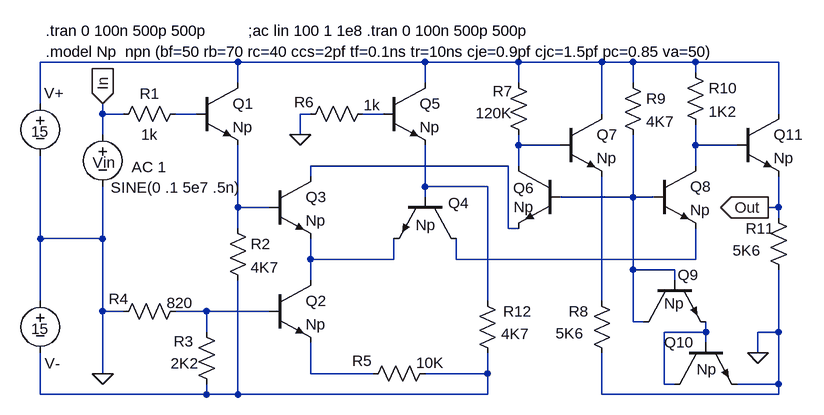
[diagram p0: schematic 9Q_50Mhz.asc]
9Q_50Mhz.asc, the LTspice schematic file:
Version 4
SHEET 1 1232 680
WIRE 32 144 32 80
WIRE 32 352 32 224
WIRE 32 448 32 352
WIRE 32 592 32 528
WIRE 128 160 128 144
WIRE 128 192 128 160
WIRE 128 352 32 352
WIRE 128 352 128 272
WIRE 128 464 128 352
WIRE 128 560 128 464
WIRE 160 160 128 160
WIRE 160 464 128 464
WIRE 272 160 240 160
WIRE 288 464 240 464
WIRE 288 496 288 464
WIRE 288 592 32 592
WIRE 288 592 288 576
WIRE 336 80 32 80
WIRE 336 112 336 80
WIRE 336 304 336 208
WIRE 336 336 336 304
WIRE 336 592 288 592
WIRE 336 592 336 416
WIRE 384 304 336 304
WIRE 384 464 288 464
WIRE 432 192 432 160
WIRE 448 160 432 160
WIRE 448 256 448 240
WIRE 448 384 448 352
WIRE 448 416 448 384
WIRE 448 560 448 512
WIRE 544 560 448 560
WIRE 560 160 528 160
WIRE 576 384 448 384
WIRE 576 384 576 352
WIRE 624 80 336 80
WIRE 624 112 624 80
WIRE 624 272 624 208
WIRE 624 288 624 272
WIRE 672 384 672 352
WIRE 720 272 624 272
WIRE 720 448 720 272
WIRE 720 560 624 560
WIRE 720 560 720 528
WIRE 720 592 336 592
WIRE 720 592 720 560
WIRE 752 240 448 240
WIRE 752 336 752 240
WIRE 768 80 624 80
WIRE 768 112 768 80
WIRE 768 208 768 192
WIRE 768 240 768 208
WIRE 768 336 752 336
WIRE 832 208 768 208
WIRE 896 80 768 80
WIRE 896 160 896 80
WIRE 896 448 896 256
WIRE 896 592 896 528
WIRE 944 80 896 80
WIRE 944 112 944 80
WIRE 944 288 832 288
WIRE 944 288 944 192
WIRE 944 400 944 288
WIRE 944 480 944 400
WIRE 960 480 944 480
WIRE 976 288 944 288
WIRE 992 576 992 496
WIRE 1008 400 944 400
WIRE 1008 416 1008 400
WIRE 1008 576 992 576
WIRE 1040 80 944 80
WIRE 1040 96 1040 80
WIRE 1040 208 1040 176
WIRE 1040 240 1040 208
WIRE 1040 384 672 384
WIRE 1040 384 1040 336
WIRE 1056 496 992 496
WIRE 1056 496 1056 480
WIRE 1056 512 1056 496
WIRE 1104 208 1040 208
WIRE 1136 528 1136 496
WIRE 1168 80 1040 80
WIRE 1168 160 1168 80
WIRE 1168 304 1152 304
WIRE 1168 304 1168 256
WIRE 1168 320 1168 304
WIRE 1168 496 1136 496
WIRE 1168 496 1168 400
WIRE 1168 576 1104 576
WIRE 1168 576 1168 496
WIRE 1168 592 896 592
WIRE 1168 592 1168 576
FLAG 128 560 0
FLAG 1136 528 0
FLAG 1152 304 Out
IOPIN 1152 304 Out
FLAG 128 144 In
IOPIN 128 144 In
FLAG 432 192 0
SYMBOL voltage 32 128 R0
WINDOW 0 6 0 Left 0
WINDOW 3 -14 59 Left 0
WINDOW 123 0 0 Left 0
WINDOW 39 0 0 Left 0
SYMATTR InstName V+
SYMATTR Value 15
SYMBOL voltage 32 432 R0
WINDOW 0 7 112 Left 0
WINDOW 3 -14 59 Left 0
WINDOW 123 0 0 Left 0
WINDOW 39 0 0 Left 0
SYMATTR InstName V-
SYMATTR Value 15
SYMBOL res 256 144 R90
WINDOW 0 0 56 VBottom 0
WINDOW 3 32 56 VTop 0
SYMATTR InstName R1
SYMATTR Value 1k
SYMBOL npn3 272 112 R0
SYMATTR InstName Q1
SYMATTR Value Np
SYMBOL res 320 320 R0
SYMATTR InstName R2
SYMATTR Value 4K7
SYMBOL npn3 384 256 R0
SYMATTR InstName Q3
SYMATTR Value Np
SYMBOL npn3 384 416 R0
SYMATTR InstName Q2
SYMATTR Value Np
SYMBOL res 272 480 R0
WINDOW 0 -35 30 Left 0
WINDOW 3 -39 64 Left 0
SYMATTR InstName R3
SYMATTR Value 2K2
SYMBOL res 256 448 R90
WINDOW 0 12 103 VBottom 0
WINDOW 3 -13 9 VTop 0
SYMATTR InstName R4
SYMATTR Value 820
SYMBOL res 528 576 R270
WINDOW 0 20 -1 VTop 0
WINDOW 3 48 104 VBottom 0
SYMATTR InstName R5
SYMATTR Value 10K
SYMBOL npn3 672 288 R90
WINDOW 0 9 -20 VRight 0
WINDOW 3 43 32 VRight 0
SYMATTR InstName Q4
SYMATTR Value Np
SYMBOL npn3 560 112 R0
SYMATTR InstName Q5
SYMATTR Value Np
SYMBOL res 704 432 R0
WINDOW 0 40 32 Left 0
WINDOW 3 37 67 Left 0
SYMATTR InstName R12
SYMATTR Value 4K7
SYMBOL npn3 832 240 M0
WINDOW 0 40 34 Left 0
WINDOW 3 41 63 Left 0
SYMATTR InstName Q6
SYMATTR Value Np
SYMBOL res 752 96 R0
WINDOW 0 -24 29 Left 0
WINDOW 3 -50 63 Left 0
SYMATTR InstName R7
SYMATTR Value 120K
SYMBOL npn3 832 160 R0
SYMATTR InstName Q7
SYMATTR Value Np
SYMBOL res 880 432 R0
WINDOW 0 -35 32 Left 0
WINDOW 3 -55 66 Left 0
SYMATTR InstName R8
SYMATTR Value 5K6
SYMBOL npn3 976 240 R0
SYMATTR InstName Q8
SYMATTR Value Np
SYMBOL res 928 96 R0
SYMATTR InstName R9
SYMATTR Value 4K7
SYMBOL res 1024 80 R0
SYMATTR InstName R10
SYMATTR Value 1K2
SYMBOL npn3 960 416 M90
WINDOW 0 -8 85 VLeft 0
WINDOW 3 36 63 VLeft 0
SYMATTR InstName Q9
SYMATTR Value Np
SYMBOL npn3 1008 512 M90
WINDOW 0 0 30 VLeft 0
WINDOW 3 41 65 VLeft 0
SYMATTR InstName Q10
SYMATTR Value Np
SYMBOL npn3 1104 160 R0
SYMATTR InstName Q11
SYMATTR Value Np
SYMBOL res 1152 304 R0
WINDOW 0 -35 32 Left 0
WINDOW 3 -55 66 Left 0
SYMATTR InstName R11
SYMATTR Value 5K6
SYMBOL voltage 128 176 R0
WINDOW 0 -15 59 Left 0
WINDOW 3 12 97 Left 0
WINDOW 123 45 66 Left 0
WINDOW 39 0 0 Left 0
SYMATTR InstName Vin
SYMATTR Value SINE(0 .1 5e7 .5n)
SYMATTR Value2 AC 1
SYMBOL res 544 144 R90
WINDOW 0 13 106 VBottom 0
WINDOW 3 -13 2 VTop 0
SYMATTR InstName R6
SYMATTR Value 1k
TEXT 40 64 Left 0 !.model Np  npn (bf=50 rb=70 rc=40 ccs=2pf tf=0.1ns tr=10ns cje=0.9pf cjc=1.5pf pc=0.85 va=50)
TEXT 40 32 Left 0 !.tran 0 100n 500p 500p
TEXT 352 32 Left 0 !;ac lin 100 1 1e8 .tran 0 100n 500p 500p

The netlist it stands for:
* 9Q_50Mhz.asc
V+ N001 0 15
V- 0 N002 15
R1 N003 In 1k
Q1 N001 N003 N005 0 Np
R2 N005 N002 4K7
Q3 N006 N005 N007 0 Np
Q2 N007 N004 N008 0 Np
R3 N004 N002 2K2
R4 N004 0 820
R5 N008 N002 10K
Q4 N011 N010 N007 0 Np
Q5 N001 N009 N010 0 Np
R12 N010 N002 4K7
Q6 N012 N014 N006 0 Np
R7 N001 N012 120K
Q7 N001 N012 N013 0 Np
R8 N013 0 5K6
Q8 N016 N014 N011 0 Np
R9 N001 N014 4K7
R10 N001 N016 1K2
Q9 N014 N014 N015 0 Np
Q10 N015 N015 0 0 Np
Q11 N001 N016 Out 0 Np
R11 Out 0 5K6
Vin In 0 SINE(0 .1 5e7 .5n) AC 1
R6 N009 0 1k
.model NPN NPN
.model PNP PNP
.lib standard.bjt
.model Np  npn (bf=50 rb=70 rc=40 ccs=2pf tf=0.1ns tr=10ns cje=0.9pf cjc=1.5pf pc=0.85 va=50)
.tran 0 100n 500p 500p
;ac lin 100 1 1e8 .tran 0 100n 500p 500p
.backanno
.end